# Altium schematic sheet 04_POWER_TREE.SchDoc
size 420 x 297 mm; SheetNumber: 4; SheetTotal: 35
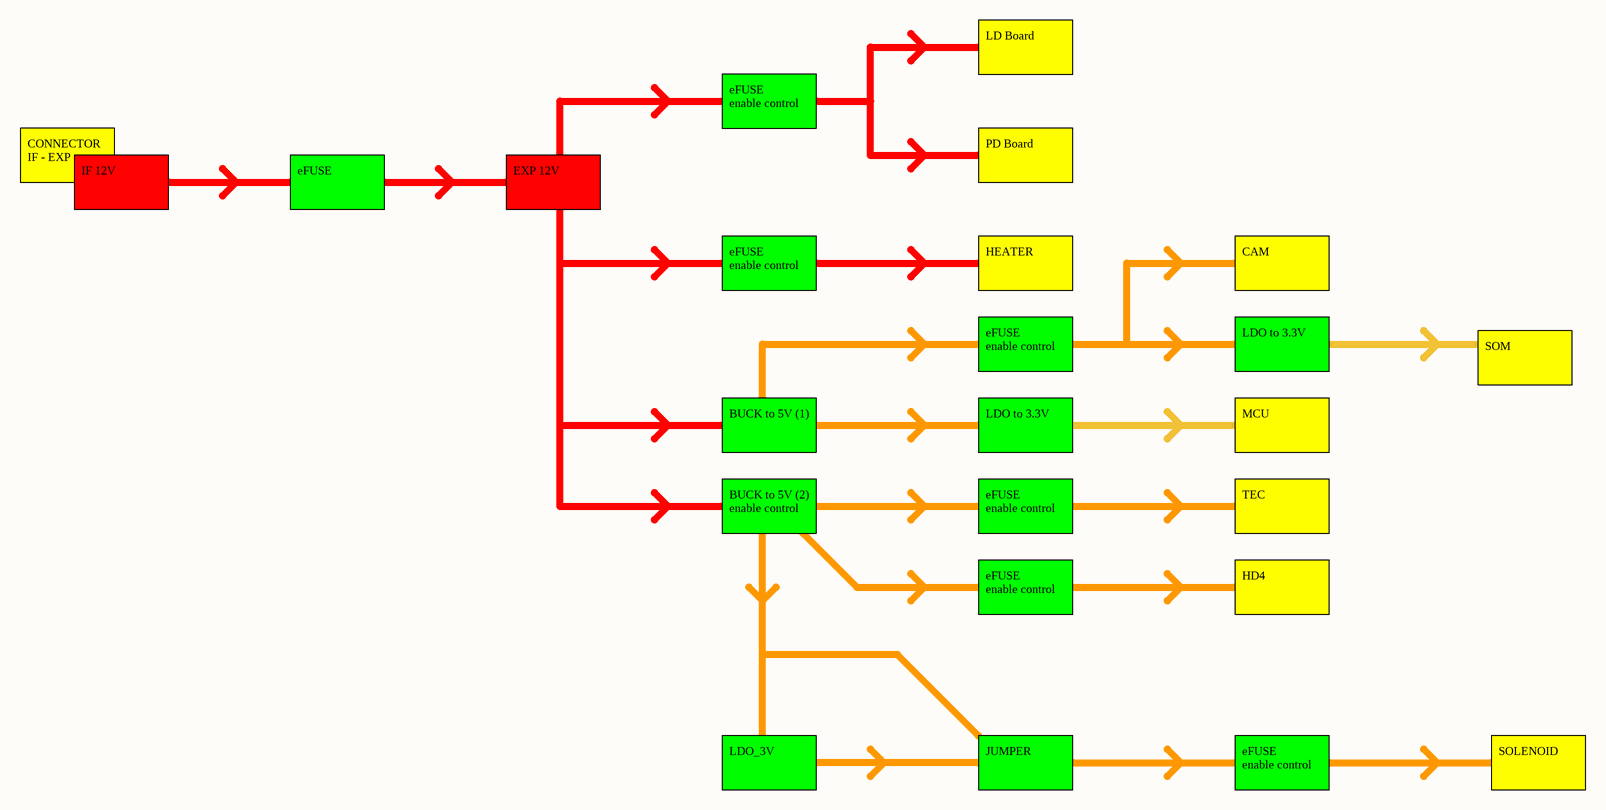
[diagram p0: 04_POWER_TREE.SchDoc]

## Notes on the sheet
- LD Board
- eFUSE
  enable control
- CONNECTOR
  IF - EXP
- IF 12V
- eFUSE
- EXP 12V
- PD Board
- HEATER
- CAM
- LDO to 3.3V
- SOM
- BUCK to 5V (1)
- MCU
- BUCK to 5V (2)
  enable control
- TEC
- HD4
- LDO_3V
- JUMPER
- SOLENOID
- Project:
- Sub-system:
- Design by:
- Sheet title:
- Sheet
- of
- Checked by:
- Approved by:
- Revision:
- Document No:
- Size:
- Date:
- A3